# Altium project Buddy.PrjPcb
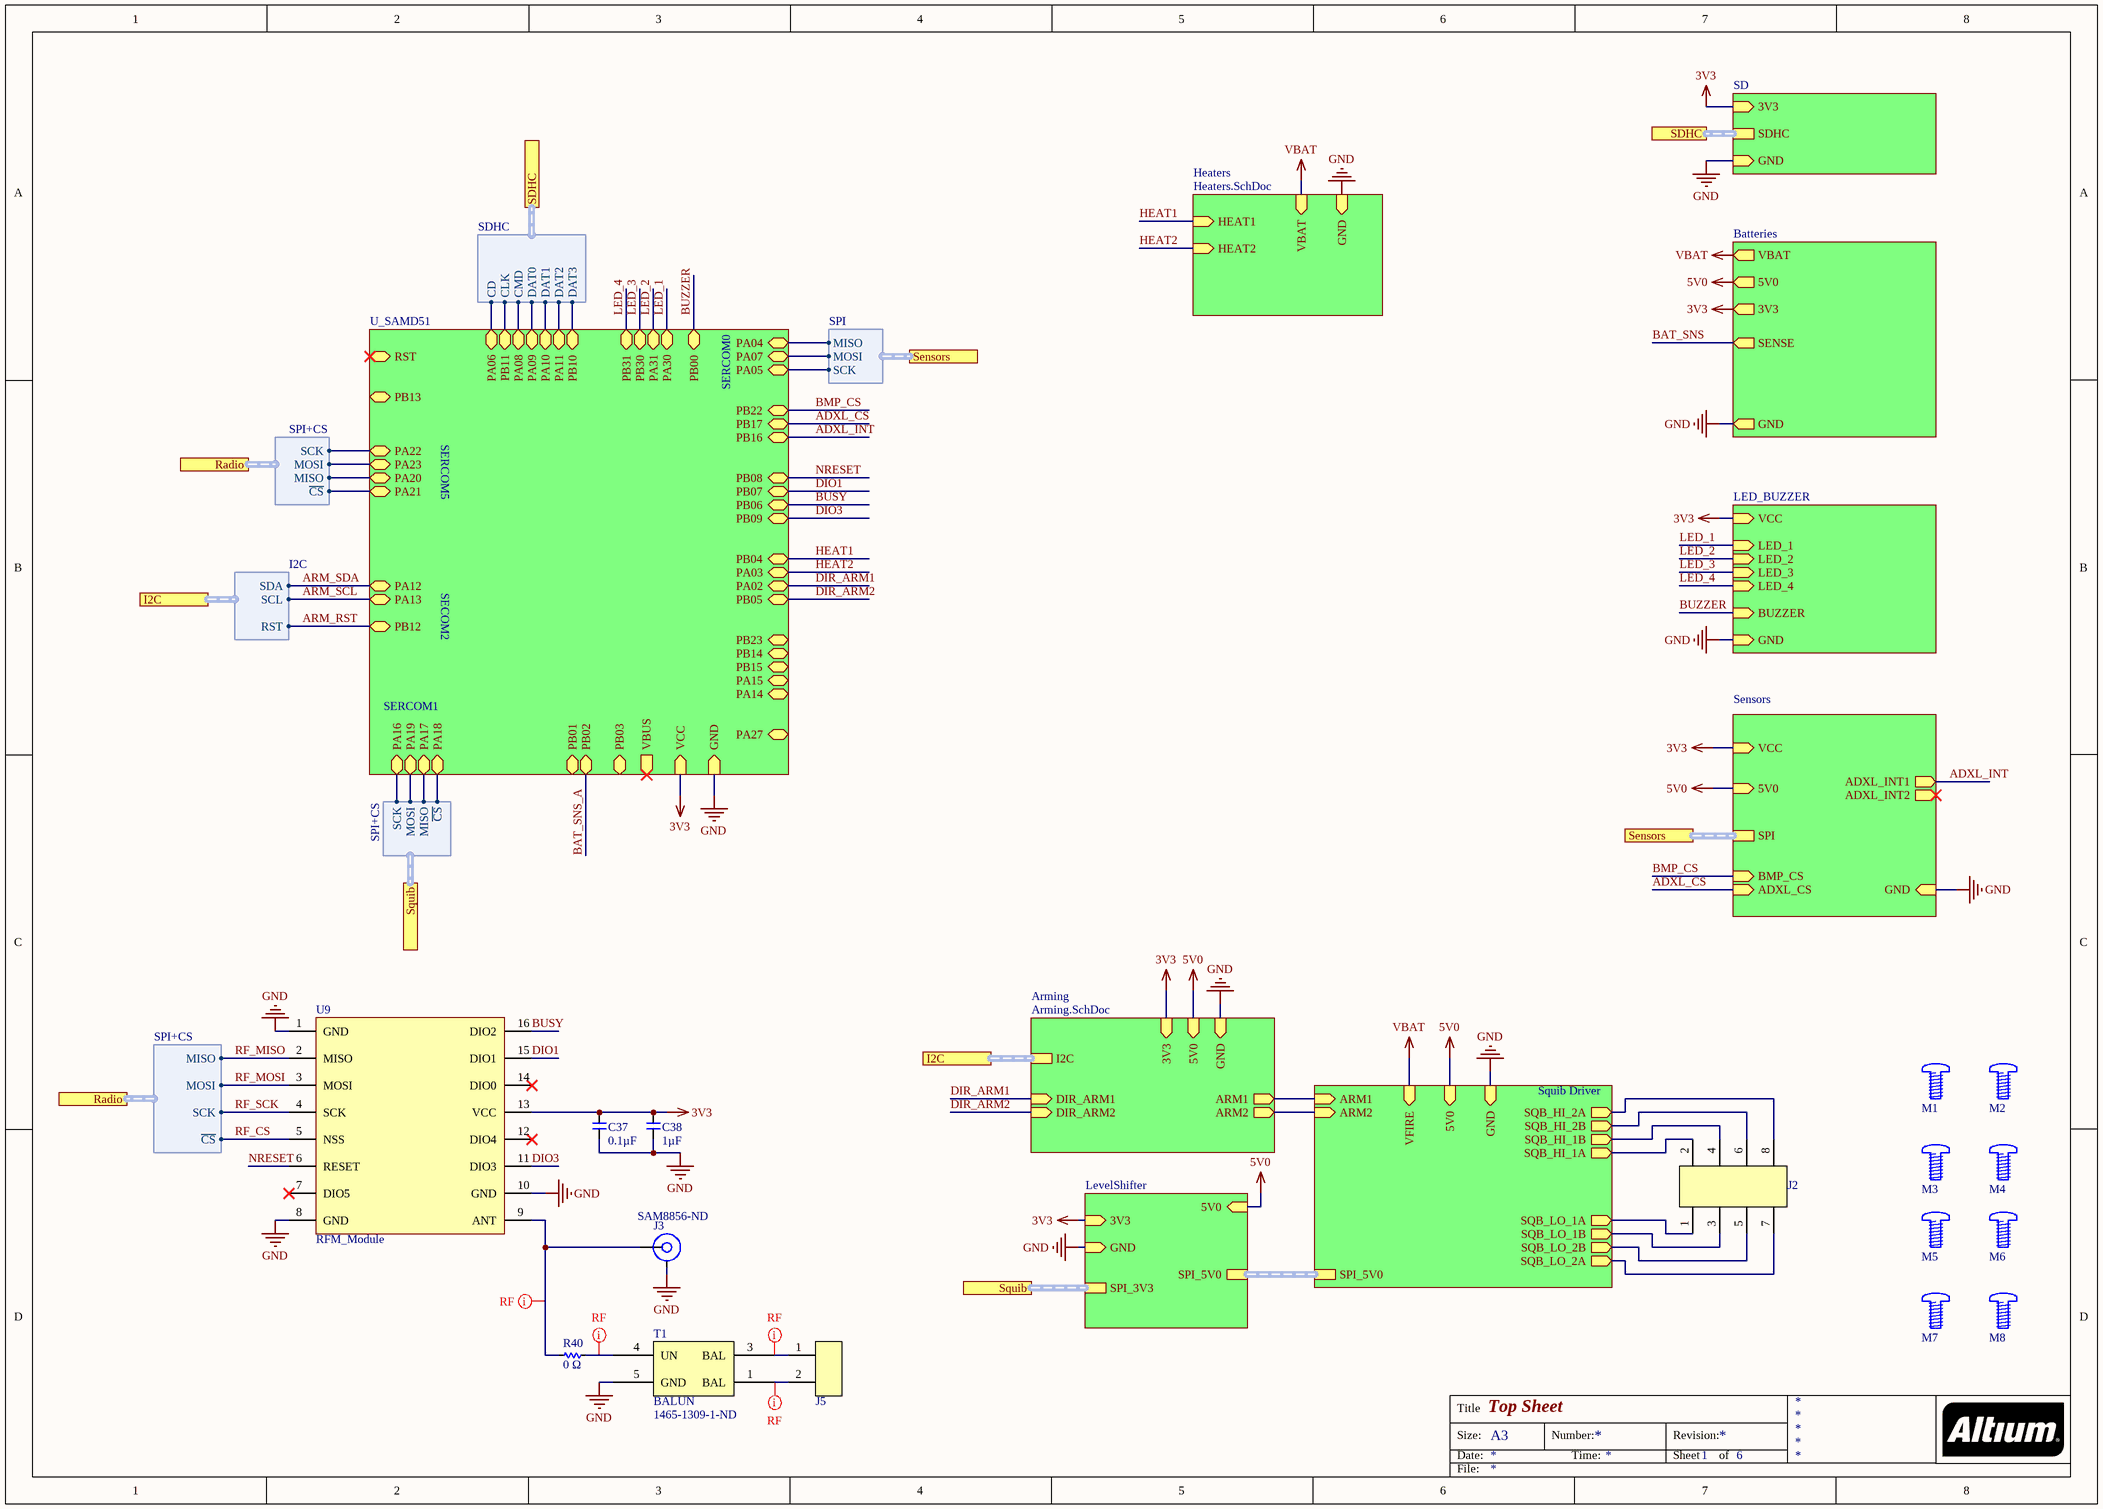
[diagram p0: Buddy.SchDoc]
prjEngineer1: John Dean; prjEngineer2: Rebecca Wong; prjReviewDate: 2016-10-31; prjReviewer: Sasha Maldonado; prjRevision: 0; prjTitle: IREC SRAD Altimeter
4 sheets, 41 parts. Net scope: strictly hierarchical (ports join the sheet entries above them; power ports are local).
Board file: Buddy.PcbDoc
Sheets:
  Buddy.SchDoc
    Squib Driver = MC33797.SchDoc
    LevelShifter = LevelShifter.SchDoc
    Arming = Arming.SchDoc

## Sheet Buddy.SchDoc: Top Sheet
size A3; SheetNumber: 1; SheetTotal: 6; DocumentName: Top Sheet

### Parts
C37  Capacitance (shorthand): 0.1µF  [C0603]  (hidden comment: __template_cap)
C38  Capacitance (shorthand): 1µF  [C0603]  (hidden comment: __template_cap)
J2  CONN_2x4_Harwin-M80-5T108  [Harwin M80-5T108]  (value not drawn)
J3  Supplier Part Number 1: SAM8856-ND  [SMA_SAMTEC_SMA-J-P-X-RA-TH1]  (hidden comment: SMA_SAMTEC_TH_RA)
J5  CONN HEADER 2POS VERT T/H  [CONN_1x2_100MIL]  (value not drawn)
M1  SCREW_#4-40  [#4_HOLE]  (value not drawn)
M2  SCREW_#4-40  [#4_HOLE]  (value not drawn)
M3  SCREW_#4-40  [#4_HOLE]  (value not drawn)
M4  SCREW_#4-40  [#4_HOLE]  (value not drawn)
M5  SCREW_#4-40  [#4_HOLE]  (value not drawn)
M6  SCREW_#4-40  [#4_HOLE]  (value not drawn)
M7  SCREW_#4-40  [#4_HOLE]  (value not drawn)
M8  SCREW_#4-40  [#4_HOLE]  (value not drawn)
R40  Resistance: 0 Ω  [R0402]  (hidden comment: __template_resistor)
T1  BALUN  Supplier Part Number 1: 1465-1309-1-ND  [BALUN_MABA-010245-CT1160]
U9  RFM_Module  [RFM-22]

### Sub-sheets
Arming = Arming.SchDoc: DIR_ARM1 (in), DIR_ARM2 (in), ARM2 (out), ARM1 (out), 5V0 (in), GND (in), I2C (harness I2C), 3V3 (in)
Batteries = Battery_Management (file not in this document): SENSE (out), 5V0 (out), GND (out), 3V3 (out), VBAT (out)
Heaters = Heaters.SchDoc (file not in this document): GND (in), HEAT2 (in), VBAT (in), HEAT1 (in)
LED_BUZZER = Blink_Blink_Beep_Boop (file not in this document): LED_1 (in), LED_2 (in), LED_3 (in), LED_4 (in), BUZZER (in), GND (in), VCC (in)
LevelShifter = LevelShifter.SchDoc: SPI_3V3 (harness SPI+CS), SPI_5V0 (harness SPI+CS), 5V0 (in), 3V3 (in), GND (in)
SD = SD.SchDoc (file not in this document): SDHC (harness SDHC), GND (in), 3V3 (in)
Sensors = Sensors.SchDoc (file not in this document): SPI (harness SPI), BMP_CS (in), ADXL_CS (in), ADXL_INT1 (out), ADXL_INT2 (out), GND (in), VCC (in), 5V0 (in)
Squib Driver = MC33797.SchDoc: SPI_5V0 (harness SPI+CS), SQB_LO_1A (out), SQB_HI_1A (out), SQB_LO_1B (out), SQB_HI_1B (out), SQB_HI_2A (out), SQB_LO_2A (out), ARM1 (in), ARM2 (in), 5V0 (in), VFIRE (in), GND (in), SQB_HI_2B (out), SQB_LO_2B (out)
U_SAMD51 = SAMD51.SchDoc (file not in this document): PA12 (bidir), PA13 (bidir), PA05 (bidir), PA07 (bidir), PA04 (bidir), PA06 (bidir), PB11 (bidir), PA08 (bidir), PA09 (bidir), PA10 (bidir), PA11 (bidir), PB10 (bidir), PB12 (bidir), PB13 (bidir), PA22 (bidir), PA23 (bidir), PA16 (bidir), PA19 (bidir), PA17 (bidir), PA20 (bidir), PA21 (bidir), PB08 (bidir), PB07 (bidir), PB06 (bidir), PB09 (bidir), PB04 (bidir), PA03 (bidir), PA02 (bidir), PB05 (bidir), PB00 (bidir), PB30 (bidir), PA31 (bidir), PA30 (bidir), PB31 (bidir), PB16 (bidir), PA14 (bidir), PB17 (bidir), PB23 (bidir), PB22 (bidir), PA27 (bidir), PB02 (bidir), PB01 (bidir), PB03 (bidir), PA18 (bidir), GND (in), VCC (in), VBUS (out), PB14 (bidir), PB15 (bidir), PA15 (bidir), RST (bidir)

### Ports
I2C (harness I2C), Radio (harness SPI+CS), SDHC, SDHC (harness SDHC), Sensors (harness SPI), Squib (harness SPI+CS)

### Harnesses
SPI: MISO, MOSI, SCK
SDHC: CD, CLK, CMD, DAT0, DAT1, DAT2, DAT3
SPI+CS: MISO, MOSI, SCK, ~{CS}
I2C: SCL, SDA, RST

### Nets
3V3: C37.1 C38.1 U9.13(VCC) ; sheet Sensors/VCC, sheet Batteries/3V3, sheet LED_BUZZER/VCC, sheet U_SAMD51/VCC, sheet LevelShifter/3V3, sheet SD/3V3, sheet Arming/3V3
5V0: sheet Sensors/5V0, sheet Batteries/5V0, sheet Squib Driver/5V0, sheet LevelShifter/5V0, sheet Arming/5V0
GND: C37.2 C38.2 J3.GND T1.5(GND) U9.1(GND) U9.8(GND) U9.10(GND) ; sheet Sensors/GND, sheet Batteries/GND, sheet LED_BUZZER/GND, sheet U_SAMD51/GND, sheet Squib Driver/GND, sheet LevelShifter/GND, sheet SD/GND, sheet Arming/GND, sheet Heaters/GND
VBAT: sheet Batteries/VBAT, sheet Squib Driver/VFIRE, sheet Heaters/VBAT
ADXL_CS: sheet Sensors/ADXL_CS, sheet U_SAMD51/PB17
ADXL_INT: sheet Sensors/ADXL_INT1, sheet U_SAMD51/PB16
ARM1: sheet Squib Driver/ARM1, sheet Arming/ARM1
ARM2: sheet Squib Driver/ARM2, sheet Arming/ARM2
ARM_RST: sheet U_SAMD51/PB12, port I2C.RST
ARM_SCL: sheet U_SAMD51/PA13, port I2C.SCL
ARM_SDA: sheet U_SAMD51/PA12, port I2C.SDA
BAT_SNS: sheet Batteries/SENSE
BAT_SNS_A: sheet U_SAMD51/PB02
BMP_CS: sheet Sensors/BMP_CS, sheet U_SAMD51/PB22
BUSY: U9.16(DIO2) ; sheet U_SAMD51/PB06
BUZZER: sheet LED_BUZZER/BUZZER, sheet U_SAMD51/PB00
DIO1: U9.15(DIO1) ; sheet U_SAMD51/PB07
DIO3: U9.11(DIO3) ; sheet U_SAMD51/PB09
DIR_ARM1: sheet U_SAMD51/PA02, sheet Arming/DIR_ARM1
DIR_ARM2: sheet U_SAMD51/PB05, sheet Arming/DIR_ARM2
HEAT1: sheet U_SAMD51/PB04, sheet Heaters/HEAT1
HEAT2: sheet U_SAMD51/PA03, sheet Heaters/HEAT2
LED_1: sheet LED_BUZZER/LED_1, sheet U_SAMD51/PA30
LED_2: sheet LED_BUZZER/LED_2, sheet U_SAMD51/PA31
LED_3: sheet LED_BUZZER/LED_3, sheet U_SAMD51/PB30
LED_4: sheet LED_BUZZER/LED_4, sheet U_SAMD51/PB31
NRESET: U9.6(RESET) ; sheet U_SAMD51/PB08
RF_CS: U9.5(NSS) ; sheet U_SAMD51/PA21, port Radio.~{CS}
RF_MISO: U9.2(MISO) ; sheet U_SAMD51/PA20, port Radio.MISO
RF_MOSI: U9.3(MOSI) ; sheet U_SAMD51/PA23, port Radio.MOSI
RF_SCK: U9.4(SCK) ; sheet U_SAMD51/PA22, port Radio.SCK
SQB_HI_1A: J2.2 ; sheet Squib Driver/SQB_HI_1A
SQB_HI_1B: J2.4 ; sheet Squib Driver/SQB_HI_1B
SQB_HI_2A: J2.8 ; sheet Squib Driver/SQB_HI_2A
SQB_HI_2B: J2.6 ; sheet Squib Driver/SQB_HI_2B
SQB_LO_1A: J2.1 ; sheet Squib Driver/SQB_LO_1A
SQB_LO_1B: J2.3 ; sheet Squib Driver/SQB_LO_1B
SQB_LO_2A: J2.7 ; sheet Squib Driver/SQB_LO_2A
SQB_LO_2B: J2.5 ; sheet Squib Driver/SQB_LO_2B
NetJ3_SIG: J3.SIG R40.1 U9.9(ANT)
NetJ5_1: J5.1 T1.3(BAL)
NetJ5_2: J5.2 T1.1(BAL)
NetR40_2: R40.2 T1.4(UN)
NetU4_2: sheet U_SAMD51/PA18, port Squib.~{CS}
NetU4_3: sheet U_SAMD51/PA17, port Squib.MISO
NetU4_4: sheet U_SAMD51/PA16, port Squib.SCK
NetU4_5: sheet U_SAMD51/PA19, port Squib.MOSI
(unnamed): sheet U_SAMD51/PA05, port Sensors.SCK
(unnamed): sheet U_SAMD51/PA07, port Sensors.MOSI
(unnamed): sheet U_SAMD51/PA04, port Sensors.MISO
(unnamed): sheet U_SAMD51/PA06, port SDHC.CD
(unnamed): sheet U_SAMD51/PB11, port SDHC.CLK
(unnamed): sheet U_SAMD51/PA08, port SDHC.CMD
(unnamed): sheet U_SAMD51/PA09, port SDHC.DAT0
(unnamed): sheet U_SAMD51/PA10, port SDHC.DAT1
(unnamed): sheet U_SAMD51/PA11, port SDHC.DAT2
(unnamed): sheet U_SAMD51/PB10, port SDHC.DAT3

Not connected (* = marked no-connect by the designer): M1 HOLE(0); M2 HOLE(0); M3 HOLE(0); M4 HOLE(0); M5 HOLE(0); M6 HOLE(0); M7 HOLE(0); M8 HOLE(0); U9 7(DIO5)* 12(DIO4)* 14(DIO0)*

### Buses and harness runs
harness port I2C = sheet Arming/I2C
harness port SDHC = sheet SD/SDHC
harness port Sensors = sheet Sensors/SPI
harness port Squib = sheet LevelShifter/SPI_3V3
harness sheet LevelShifter/SPI_5V0 = sheet Squib Driver/SPI_5V0

### Layout directives
rule Clearance Constraint [Generic clearance = 0mil, and 21 value(s) for objects]: NetJ3_SIG, NetJ5_1, NetJ5_2, NetR40_2

### Notes on the sheet
- SERCOM5
- SERCOM0
- SECOM2
- SERCOM1
- Title
- Size:
- Date:
- A3
- Number:
- Time:
- Revision:
- Sheet
- of
- File:

### Library data of the parts
C37 = 490-1519-1-ND: CAP CER 0603 0.1µF X7R 50V 10%; Manufacturer: Murata Electronics North America; Capacitance - pF (Machine readable): #NAME?; type: capacitor; Rated Voltage: 50V; Supplier Part Number 1: 490-1519-1-ND; Dielectric: X7R; Supplier 1: Digikey
C38 = 490-3900-1-ND: CAP CER 0603 1µF X7R 16V 10%; Manufacturer: Murata Electronics North America; Capacitance - pF (Machine readable): #NAME?; type: capacitor; Rated Voltage: 16V; Supplier Part Number 1: 490-3900-1-ND; Dielectric: X7R; Supplier 1: Digikey
J5 = CONN_1x2: Manufacturer: FCI; Manufacturer Part Number: 77311-118-02LF; Connector Type: Header, Unshrouded; Number of Positions: 2; Number of Positions Loaded: All; Pitch: 0.100" (2.54mm); RoHS: RoHS Compliant; Category: Connectors, Interconnects; Contact Type: Male Pin; Number of Rows: 1; Row Spacing: -; Contact Mating Length: 0.230" (5.84mm); Mounting Type: Through Hole; Termination: Solder; Fastening Type: -; Features: -; Contact Finish: Gold, GXT™; Contact Finish Thickness: 30µin (0.76µm); Color: Black; Packaging: Bulk; ComponentLink1URL: http://portal.fciconnect.com/res/en/pdffiles/doc_search//77311.pdf; ComponentLink1Description: http://portal.fciconnect.com/res/en/pdffiles/doc_search//77311.pdf
M1-M8 = SCREW_#4-40: #4-40 Button Head Screw
R40 = 311-0.0LRCT-ND: RES SMD 0 OHM JUMPER 1/16W 0402; Manufacturer Part Number: RC0402FR-070RL; Manufacturer: Yageo; Resistance (Sortable): 0; Power (Watts): 0.063W, 1/16W; Supplier Part Number 1: 311-0.0LRCT-ND; Supplier 1: Digikey; Datasheets: http://www.yageo.com/documents/recent/PYu-RC_Group_51_RoHS_L_9.pdf; Image: //media.digikey.com/Renders/Yageo%20Renders/0402-(1005-Metric).jpg; Tolerance: Jumper; Temperature Coefficient: -; Operating Temperature: -55°C ~ 155°C
J3 = SMA_SAMTEC_TH_RA: Supplier 1: Digi-Key
T1 = BALUN: Supplier 1: Digi-Key

## Sheet MC33797.SchDoc: Top Sheet
size A4; Project: World Domination Satellite
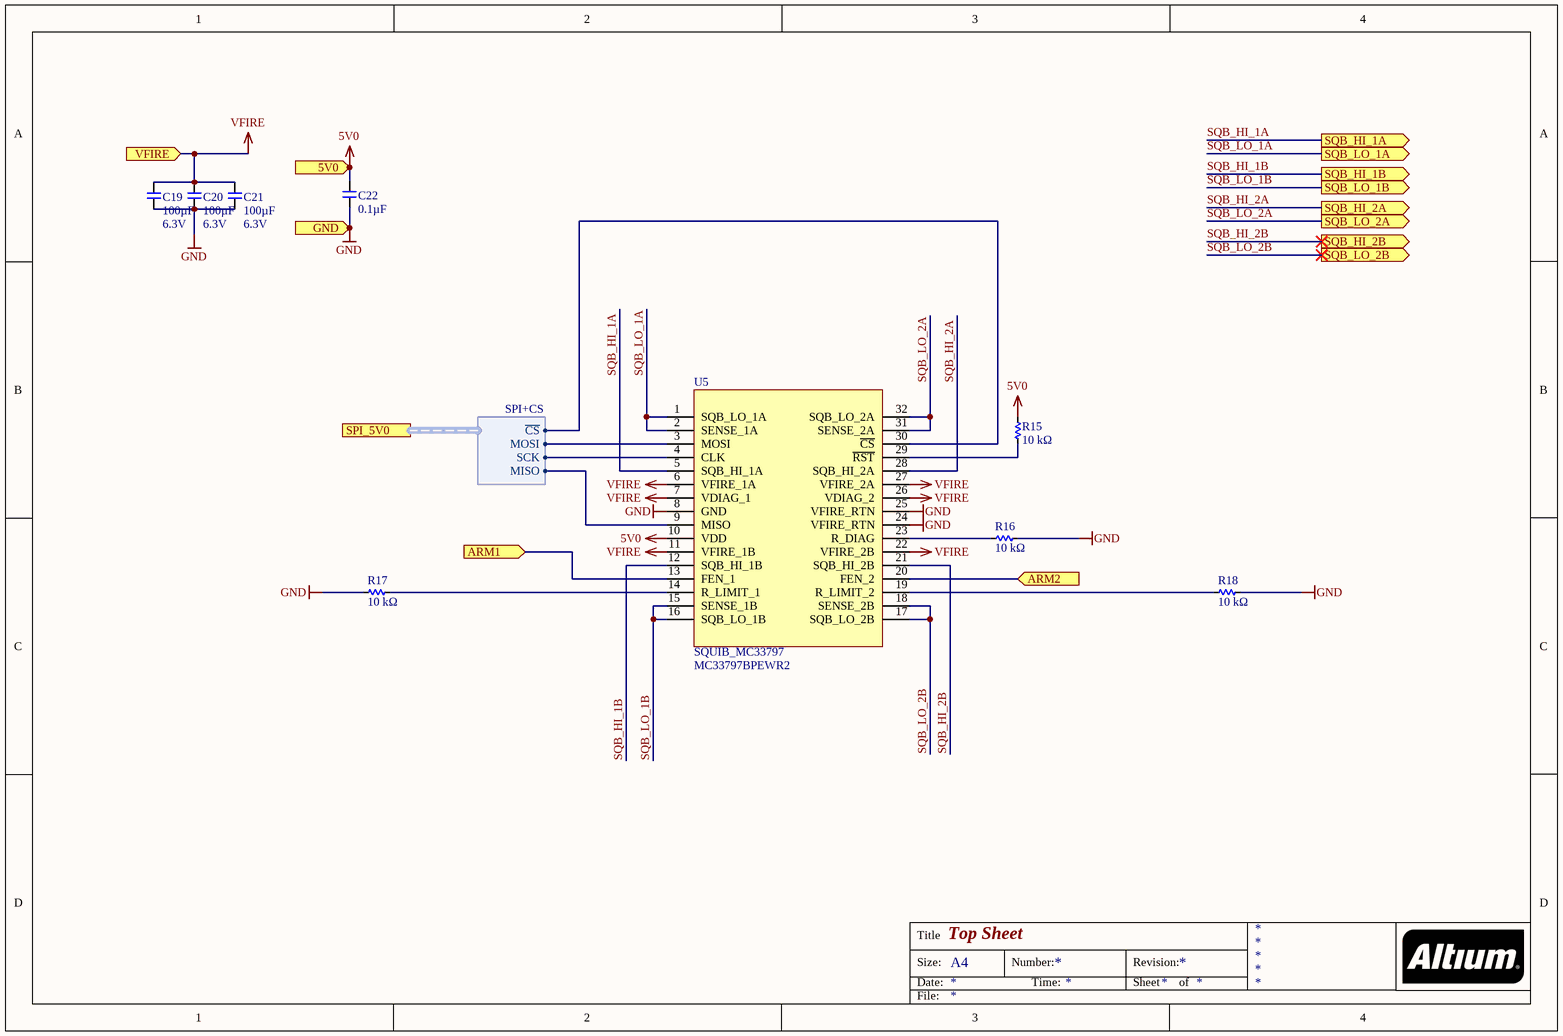
[diagram p1: MC33797.SchDoc]

### Parts
C19  Capacitance: 100µF  Voltage - Rated: 6.3V  [C1206]  (hidden comment: CAP_100UF_1206_SMD)
C20  Capacitance: 100µF  Voltage - Rated: 6.3V  [C1206]  (hidden comment: CAP_100UF_1206_SMD)
C21  Capacitance: 100µF  Voltage - Rated: 6.3V  [C1206]  (hidden comment: CAP_100UF_1206_SMD)
C22  Capacitance (shorthand): 0.1µF  [C0603]  (hidden comment: __template_cap)
R15  Resistance: 10 kΩ  [R0603]  (hidden comment: __template_resistor)
R16  Resistance: 10 kΩ  [R0603]  (hidden comment: __template_resistor)
R17  Resistance: 10 kΩ  [R0603]  (hidden comment: __template_resistor)
R18  Resistance: 10 kΩ  [R0603]  (hidden comment: __template_resistor)
U5  SQUIB_MC33797  Manufacturer Part Number: MC33797BPEWR2  [SOT1762-1]

### Ports
5V0 (in), ARM1 (in), ARM2 (in), GND (in), SPI_5V0 (harness SPI+CS), SQB_HI_1A (out), SQB_HI_1B (out), SQB_HI_2A (out), SQB_HI_2B (out), SQB_LO_1A (out), SQB_LO_1B (out), SQB_LO_2A (out), SQB_LO_2B (out), VFIRE (in)

### Harnesses
SPI+CS: ~{CS}, SCK, MOSI, MISO

### Nets
5V0: C22.1 R15.2 U5.10(VDD) ; port 5V0
GND: C19.2 C20.2 C21.2 C22.2 R16.2 R17.1 R18.2 U5.8(GND) U5.24(VFIRE_RTN) U5.25(VFIRE_RTN) ; port GND
VFIRE: C19.1 C20.1 C21.1 U5.6(VFIRE_1A) U5.7(VDIAG_1) U5.11(VFIRE_1B) U5.22(VFIRE_2B) U5.26(VDIAG_2) U5.27(VFIRE_2A) ; port VFIRE  [project net VBAT]
ARM1: U5.13(FEN_1) ; port ARM1
ARM2: U5.20(FEN_2) ; port ARM2
SQB_HI_1A: U5.5(SQB_HI_1A) ; port SQB_HI_1A
SQB_HI_1B: U5.12(SQB_HI_1B) ; port SQB_HI_1B
SQB_HI_2A: U5.28(SQB_HI_2A) ; port SQB_HI_2A
SQB_HI_2B: U5.21(SQB_HI_2B) ; port SQB_HI_2B
SQB_LO_1A: U5.1(SQB_LO_1A) U5.2(SENSE_1A) ; port SQB_LO_1A
SQB_LO_1B: U5.15(SENSE_1B) U5.16(SQB_LO_1B) ; port SQB_LO_1B
SQB_LO_2A: U5.31(SENSE_2A) U5.32(SQB_LO_2A) ; port SQB_LO_2A
SQB_LO_2B: U5.17(SQB_LO_2B) U5.18(SENSE_2B) ; port SQB_LO_2B
NetR15_1: R15.1 U5.29(~{RST})
NetR16_1: R16.1 U5.23(R_DIAG)
NetR17_2: R17.2 U5.14(R_LIMIT_1)
NetR18_1: R18.1 U5.19(R_LIMIT_2)
NetU4_10: U5.3(MOSI) ; port SPI_5V0.MOSI
NetU4_11: U5.4(CLK) ; port SPI_5V0.SCK
NetU4_12: U5.9(MISO) ; port SPI_5V0.MISO
NetU4_13: U5.30(~{CS}) ; port SPI_5V0.~{CS}

### Notes on the sheet
- Title
- Size:
- Date:
- A4
- Number:
- Time:
- Revision:
- Sheet
- of
- File:

### Library data of the parts
C19-C21 = CAP_100UF_1206_SMD: 100UF SMD CAP CERAMIC; Manufacturer: Murata Electronics North America; Manufacturer Part Number: GRM31CD80J107ME39L; Tolerance: ±20%; Temperature Coefficient: X6T; RoHS: RoHS Compliant; Category: Capacitors; Packaging: Cut Tape (CT); Part Status: Active; Operating Temperature: -55°C ~ 105°C; Features: Derating Recommended; Ratings: -; Applications: General Purpose; Mounting Type: Surface Mount, MLCC; Package / Case: 1206 (3216 Metric); Size / Dimension: 0.126" L x 0.063" W (3.20mm x 1.60mm); Height - Seated (Max): -; Thickness (Max): 0.071" (1.80mm); Lead Spacing: -; Lead Style: -; Supplier 1: Digi-Key; Supplier Part Number 1: 490-10525-1-ND; Stock 1: 406964; Pricing 1: 1=0.55, 10=0.388, 25=0.3308, 50=0.2932, 100=0.2553, 250=0.21748, 500=0.1891, 1000=0.16074 (USD); ComponentLink1URL: http://www.murata.com/~/media/webrenewal/support/library/catalog/products/capacitor/mlcc/c02e.ashx; ComponentLink1Description: http://www.murata.com/~/media/webrenewal/support/library/catalog/products/capacitor/mlcc/c02e.ashx
C22 = 490-1519-1-ND: as C37 on sheet Buddy; Rated Voltage: 50V; Dielectric: X7R; Supplier Part Number 1: 490-1519-1-ND; Supplier 1: Digikey
R15-R18 = 311-10.0KHRCT-ND: RES SMD 10K OHM 1% 1/10W 0603; Manufacturer Part Number: RC0603FR-0710KL; Manufacturer: Yageo; Resistance (Sortable): 10000; Power (Watts): 0.1W, 1/10W; Temperature Coefficient: ±100ppm/°C; Supplier 1: Digikey; Datasheets: http://www.yageo.com/documents/recent/PYu-RC_Group_51_RoHS_L_9.pdf; Image: //media.digikey.com/Renders/Yageo%20Renders/0603-(1608-Metric).jpg; Supplier Part Number 1: 311-10.0KHRCT-ND; Tolerance: ±1%; Operating Temperature: -55°C ~ 155°C
U5 = SQUIB_MC33797: Manufacturer: NXP USA Inc.; Interface: SPI; Voltage - Supply: 4.75 V ~ 5.25 V; Supplier 1: Digi-Key; RoHS: RoHS Compliant; Category: Integrated Circuits (ICs); Stock 1: 657; Pricing 1: 1=4.94, 10=4.437, 100=3.6354, 500=3.2136 (USD); Packaging: Cut Tape (CT); Part Status: Active; Applications: -; Package / Case: 32-SOIC (0.295", 7.50mm Width); Supplier Device Package: 32-SOIC; Mounting Type: Surface Mount; ComponentLink1URL: http://cache.freescale.com/files/analog/doc/data_sheet/MC33797.pdf; ComponentLink1Description: http://cache.freescale.com/files/analog/doc/data_sheet/MC33797.pdf; Supplier Part Number 1: MC33797BPEWR2CT-ND

## Sheet LevelShifter.SchDoc: Top Sheet
size A4; Project: World Domination Satellite
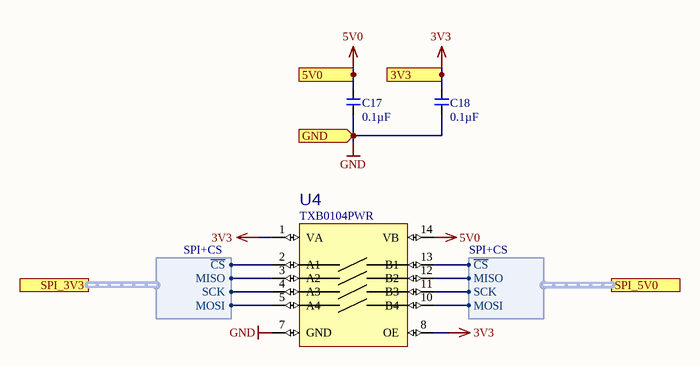
[diagram p2: LevelShifter.SchDoc]

### Parts
C17  Capacitance (shorthand): 0.1µF  [C0603]  (hidden comment: __template_cap)
C18  Capacitance (shorthand): 0.1µF  [C0603]  (hidden comment: __template_cap)
U4  Manufacturer Part Number: TXB0104PWR  [14TSSOP65]  (hidden comment: TXB0104)

### Ports
3V3 (in), 5V0 (in), GND (in), SPI_3V3 (harness SPI+CS), SPI_5V0 (harness SPI+CS)

### Harnesses
SPI+CS: ~{CS}, MISO, MOSI, SCK

### Nets
3V3: C18.1 U4.1(VA) U4.8(OE) ; port 3V3
5V0: C17.1 U4.14(VB) ; port 5V0
GND: C17.2 C18.2 U4.7(GND) ; port GND
NetU4_2: U4.2(A1) ; port SPI_3V3.~{CS}
NetU4_3: U4.3(A2) ; port SPI_3V3.MISO
NetU4_4: U4.4(A3) ; port SPI_3V3.SCK
NetU4_5: U4.5(A4) ; port SPI_3V3.MOSI
NetU4_10: U4.10(B4) ; port SPI_5V0.MOSI
NetU4_11: U4.11(B3) ; port SPI_5V0.SCK
NetU4_12: U4.12(B2) ; port SPI_5V0.MISO
NetU4_13: U4.13(B1) ; port SPI_5V0.~{CS}

### Notes on the sheet
- Title
- Size:
- Date:
- A4
- Number:
- Time:
- Revision:
- Sheet
- of
- File:

### Library data of the parts
C17 C18 = 490-1519-1-ND: as C37 on sheet Buddy; Rated Voltage: 50V; Dielectric: X7R; Supplier Part Number 1: 490-1519-1-ND; Supplier 1: Digikey
U4 = LVLSHFT_TXB0104PWR: 4 Pin Bidirectional levelshifter 5v-3.3v; Manufacturer: Texas Instruments; Translator Type: Voltage Level; Number of Circuits: 1; Channels per Circuit: 4; Voltage - VCCA: 1.2 V ~ 3.6 V; Voltage - VCCB: 1.65 V ~ 5.5 V; Output Type: Tri-State, Non-Inverted; Data Rate: 100Mbps; Value: *; Supplier 1: Digi-Key; RoHS: RoHS Compliant; Category: Integrated Circuits (ICs); Stock 1: 16134; Pricing 1: 1=1.39, 10=1.246, 100=0.9717, 500=0.8036, 1000=0.6355 (USD); Packaging: Cut Tape (CT); Channel Type: Bidirectional; Input Signal: -; Output Signal: -; Operating Temperature: -40°C ~ 85°C (TA); Features: Auto-Direction Sensing; Mounting Type: Surface Mount; Package / Case: 14-TSSOP (0.173", 4.40mm Width); Supplier Device Package: 14-TSSOP; ComponentLink1URL: http://www.ti.com/lit/ds/symlink/txb0104.pdf; ComponentLink1Description: http://www.ti.com/lit/ds/symlink/txb0104.pdf; Supplier Part Number 1: 296-21929-1-ND

## Sheet Arming.SchDoc
size A
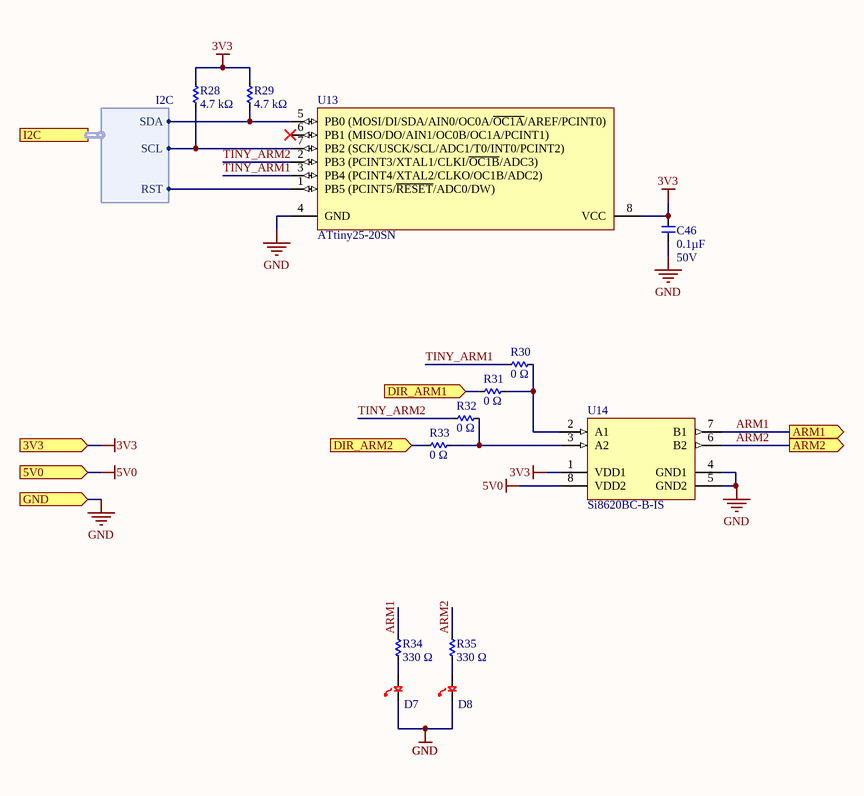
[diagram p3: Arming.SchDoc]

### Parts
C46  Capacitance (shorthand): 0.1µF  Rated Voltage: 50V  [C0603]  (hidden comment: __template_cap)
D7  LED_LY974  [0805_Diode]  (value not drawn)
D8  LED_LY974  [0805_Diode]  (value not drawn)
R28  Resistance: 4.7 kΩ  [R0603]  (hidden comment: __template_resistor)
R29  Resistance: 4.7 kΩ  [R0603]  (hidden comment: __template_resistor)
R30  Resistance: 0 Ω  [R0603]  (hidden comment: __template_resistor)
R31  Resistance: 0 Ω  [R0603]  (hidden comment: __template_resistor)
R32  Resistance: 0 Ω  [R0603]  (hidden comment: __template_resistor)
R33  Resistance: 0 Ω  [R0603]  (hidden comment: __template_resistor)
R34  Resistance: 330 Ω  [R0603]  (hidden comment: __template_resistor)
R35  Resistance: 330 Ω  [R0603]  (hidden comment: __template_resistor)
U13  ATtiny25-20SN  [8S2_N]
U14  Si8620BC-B-IS  [SLAB-SOIC-8-NB_N]

### Ports
3V3 (in), 5V0 (in), ARM1 (out), ARM2 (out), DIR_ARM1 (in), DIR_ARM2 (in), GND (in), I2C (harness I2C)

### Harnesses
I2C: SCL, SDA, RST

### Nets
3V3: C46.1 R28.2 R29.2 U13.8(VCC) U14.1(VDD1) ; port 3V3
5V0: U14.8(VDD2) ; port 5V0
GND: C46.2 D7.1 D8.1 U13.4(GND) U14.4(GND1) U14.5(GND2) ; port GND
ARM1: R34.2 U14.7(B1) ; port ARM1
ARM2: R35.2 U14.6(B2) ; port ARM2
ARM_RST: U13.1(PB5_(PCINT5/~{RESET}/ADC0/DW)) ; port I2C.RST
ARM_SCL: R28.1 U13.7(PB2_(SCK/USCK/SCL/ADC1/T0/INT0/PCINT2)) ; port I2C.SCL
ARM_SDA: R29.1 U13.5(PB0_(MOSI/DI/SDA/AIN0/OC0A/~{OC1A}/AREF/PCINT0)) ; port I2C.SDA
DIR_ARM1: R31.2 ; port DIR_ARM1
DIR_ARM2: R33.2 ; port DIR_ARM2
TINY_ARM1: R30.2 U13.3(PB4_(PCINT4/XTAL2/CLKO/OC1B/ADC2))
TINY_ARM2: R32.2 U13.2(PB3_(PCINT3/XTAL1/CLKI/~{OC1B}/ADC3))
NetD7_2: D7.2 R34.1
NetD8_2: D8.2 R35.1
NetR30_1: R30.1 R31.1 U14.2(A1)
NetR32_1: R32.1 R33.1 U14.3(A2)

Not connected (* = marked no-connect by the designer): U13 6(PB1_(MISO/DO/AIN1/OC0B/OC1A/PCINT1))*

### Library data of the parts
C46 = 490-1519-1-ND: as C37 on sheet Buddy; Supplier Part Number 1: 490-1519-1-ND; Dielectric: X7R; Supplier 1: Digikey
D7 D8 = LED_LY974: LED 0805 RED 20MA; Manufacturer: OSRAM Opto Semiconductors Inc; Manufacturer Part Number: LH R974-LP-1; Wavelength - Dominant: 645nm; Wavelength - Peak: 660nm; Millicandela Rating: 41mcd; Voltage - Forward (Vf) (Typ): 1.8V; Viewing Angle: 160°; Lens Transparency: Diffused; Lens Color: White; Lens Style/Size: Rectangle with Flat Top, 1.30mm x 1.25mm; Supplier 1: Digi-Key; RoHS: RoHS Compliant; Category: Optoelectronics; Stock 1: 66379; Pricing 1: 1=0.08, 10=0.07, 100=0.0559, 250=0.04892, 500=0.04472 (USD); Packaging: Cut Tape (CT); Color: Red; Package / Case: 0805 (2012 Metric); Supplier Device Package: *; Size / Dimension: 2.00mm L x 1.25mm W; Height (Max): 0.80mm; Mounting Type: Surface Mount; ComponentLink1URL: http://www.osram-os.com/Graphics/XPic8/00078869_0.pdf; ComponentLink1Description: http://www.osram-os.com/Graphics/XPic8/00078869_0.pdf; Supplier Part Number 1: 475-1415-1-ND; Current - Test: 20mA
R28 R29 = 311-4.70KHRCT-ND: RES SMD 4.7K OHM 1% 1/10W 0603; Manufacturer Part Number: RC0603FR-074K7L; Manufacturer: Yageo; Resistance (Sortable): 4700; Power (Watts): 0.1W, 1/10W; Temperature Coefficient: ±100ppm/°C; Supplier Part Number 1: 311-4.70KHRCT-ND; Supplier 1: Digikey; Datasheets: http://www.yageo.com/documents/recent/PYu-RC_Group_51_RoHS_L_9.pdf; Image: //media.digikey.com/Renders/Yageo%20Renders/0603-(1608-Metric).jpg; Tolerance: ±1%; Operating Temperature: -55°C ~ 155°C
R30-R33 = 311-0.0HRCT-ND: RES SMD 0 OHM JUMPER 1/10W 0603; Manufacturer Part Number: RC0603FR-070RL; Manufacturer: Yageo; Resistance (Sortable): 0; Power (Watts): 0.1W, 1/10W; Supplier Part Number 1: 311-0.0HRCT-ND; Supplier 1: Digikey; Datasheets: http://www.yageo.com/documents/recent/PYu-RC_Group_51_RoHS_L_9.pdf; Image: //media.digikey.com/Renders/Yageo%20Renders/0603-(1608-Metric).jpg; Tolerance: Jumper; Temperature Coefficient: -; Operating Temperature: -55°C ~ 155°C
R34 R35 = 311-330HRCT-ND: RES SMD 330 OHM 1% 1/10W 0603; Manufacturer Part Number: RC0603FR-07330RL; Manufacturer: Yageo; Resistance (Sortable): 330; Power (Watts): 0.1W, 1/10W; Temperature Coefficient: ±100ppm/°C; Supplier 1: Digikey; Datasheets: http://www.yageo.com/documents/recent/PYu-RC_Group_51_RoHS_L_9.pdf; Image: //media.digikey.com/Renders/Yageo%20Renders/0603-(1608-Metric).jpg; Supplier Part Number 1: 311-330HRCT-ND; Tolerance: ±1%; Operating Temperature: -55°C ~ 155°C
U13 = CMP-0093-00348-1: 8-bit AVR Microcontroller, 20MHz, 2.7-5.5V, 2KB Flash, 128 Bytes EEPROM, 128 Bytes SRAM, 8-pin SOP, Industrial Grade (-40°C to 105°C), Pb-Free; PackageVersion: revF, Apr-2008; DatasheetVersion: revN, Apr-2011; PackageReference: 8S2; ComponentLink1URL: http://www.atmel.com/; ComponentLink3Description: ATtiny25/45/85 Summary; PackageDescription: 8-Lead, 0.208" Body, Plastic Small Outline Package (EIAJ); ComponentLink2Description: ATtiny25/45/85 Datasheet; ComponentLink2URL: http://www.atmel.com/dyn/resources/prod_documents/doc2586.pdf; ComponentLink3URL: http://www.atmel.com/dyn/resources/prod_documents/2586S.pdf; ComponentLink1Description: Manufacturer URL
U14 = CMP-0512-00372-1: Low-Power Single and Dual-Channel Digital Isolator, 150 Mbps, 3.75 kVRMS Isolation Rating, -40 to 125 degC, 8-pin SOIC; Manufacturer: Silicon Labs; Isolation Rating (kV): 3.75; Channel Type: Unidirectional; AEC-Q100: TRUE; Sub-Family: Isolators; Maximum Propagation Delay (ns): 13; 10kV surge: FALSE; Maximum Data Rate (Mbps): 150; DatasheetVersion: Rev. 1.3; ComponentLink3URL: http://www.silabs.com/Support%20Documents/TechnicalDocs/Si8220-21.pdf; PackageDescription: 8-Pin Narrow Body Plastic Small Outline, Body 4.9 x 3.9 mm, Pitch 1.27 mm; ComponentLink2Description: Datasheet; ComponentLink3Description: Package Specification; ComponentLink1URL: http://www.silabs.com/; ComponentLink1Description: Manufacturer URL; Mounting Technology: Surface Mount; PartNumber: Si8620BC-B-IS; ComponentLink2URL: http://www.silabs.com/Support%20Documents/TechnicalDocs/Si861x-2x.pdf; Enable Control: FALSE; PackageReference: SOIC-8-NB

## Nets that join several sheets
3V3: Buddy (C37.1 C38.1 U9.13), LevelShifter (C18.1 U4.1 U4.8), Arming (5 pins)
5V0: MC33797 (C22.1 R15.2 U5.10), LevelShifter (C17.1 U4.14), Arming (U14.8)
GND: Buddy (7 pins), MC33797 (10 pins), LevelShifter (C17.2 C18.2 U4.7), Arming (6 pins)
ARM1: MC33797 (U5.13), Arming (R34.2 U14.7)
ARM2: MC33797 (U5.20), Arming (R35.2 U14.6)
NetU4_10: MC33797 (U5.3), LevelShifter (U4.10)
NetU4_11: MC33797 (U5.4), LevelShifter (U4.11)
NetU4_12: MC33797 (U5.9), LevelShifter (U4.12)
NetU4_13: MC33797 (U5.30), LevelShifter (U4.13)
SQB_HI_1A: Buddy (J2.2), MC33797 (U5.5)
SQB_HI_1B: Buddy (J2.4), MC33797 (U5.12)
SQB_HI_2A: Buddy (J2.8), MC33797 (U5.28)
SQB_HI_2B: Buddy (J2.6), MC33797 (U5.21)
SQB_LO_1A: Buddy (J2.1), MC33797 (U5.1 U5.2)
SQB_LO_1B: Buddy (J2.3), MC33797 (U5.15 U5.16)
SQB_LO_2A: Buddy (J2.7), MC33797 (U5.31 U5.32)
SQB_LO_2B: Buddy (J2.5), MC33797 (U5.17 U5.18)